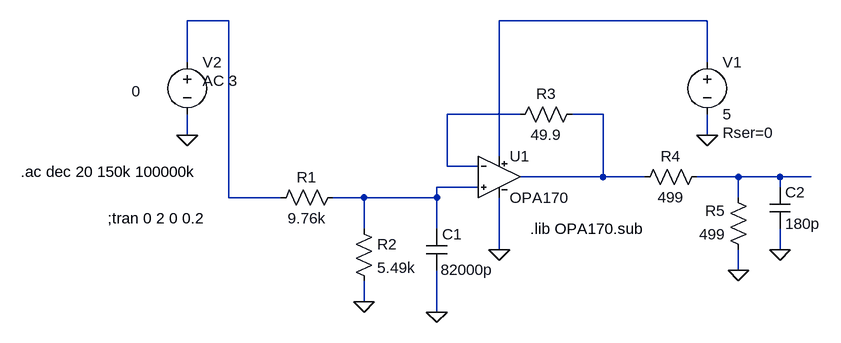
[diagram p0: schematic Analog_IN_0-10V.asc]
Analog_IN_0-10V.asc, the LTspice schematic file:
Version 4
SHEET 1 880 680
WIRE -224 -96 -288 -96
WIRE 512 -96 192 -96
WIRE -288 -32 -288 -96
WIRE 512 -32 512 -96
WIRE 224 48 112 48
WIRE 352 48 304 48
WIRE -288 80 -288 48
WIRE 512 80 512 48
WIRE 192 112 192 -96
WIRE 112 128 112 48
WIRE 160 128 112 128
WIRE 352 144 352 48
WIRE 352 144 224 144
WIRE 416 144 352 144
WIRE 560 144 496 144
WIRE 624 144 560 144
WIRE 672 144 624 144
WIRE 160 160 96 160
WIRE 624 160 624 144
WIRE -224 176 -224 -96
WIRE -144 176 -224 176
WIRE -16 176 -64 176
WIRE 96 176 96 160
WIRE 96 176 -16 176
WIRE 560 176 560 144
WIRE -16 224 -16 176
WIRE 96 224 96 176
WIRE 192 256 192 176
WIRE 624 256 624 224
WIRE 560 288 560 256
WIRE -16 336 -16 304
WIRE 96 352 96 288
FLAG -16 336 0
FLAG 512 80 0
FLAG -288 80 0
FLAG 192 256 0
FLAG 560 288 0
FLAG 96 352 0
FLAG 624 256 0
SYMBOL res -48 160 R90
WINDOW 0 0 56 VBottom 2
WINDOW 3 32 56 VTop 2
SYMATTR InstName R1
SYMATTR Value 9.76k
SYMBOL res -32 208 R0
SYMATTR InstName R2
SYMATTR Value 5.49k
SYMBOL voltage 512 -48 R0
WINDOW 123 0 0 Left 2
WINDOW 39 24 124 Left 2
SYMATTR SpiceLine Rser=0
SYMATTR InstName V1
SYMATTR Value 5
SYMBOL voltage -288 -48 R0
WINDOW 123 24 44 Left 2
WINDOW 39 24 180 Left 2
WINDOW 3 -85 60 Left 2
SYMATTR Value2 AC 3
SYMATTR InstName V2
SYMATTR Value 0
SYMBOL Opamps\\OPA170 192 80 R0
SYMATTR InstName U1
SYMBOL res 320 32 R90
WINDOW 0 0 56 VBottom 2
WINDOW 3 32 56 VTop 2
SYMATTR InstName R3
SYMATTR Value 49.9
SYMBOL res 512 128 R90
WINDOW 0 0 56 VBottom 2
WINDOW 3 32 56 VTop 2
SYMATTR InstName R4
SYMATTR Value 499
SYMBOL res 576 272 R180
WINDOW 0 36 76 Left 2
WINDOW 3 36 40 Left 2
SYMATTR InstName R5
SYMATTR Value 499
SYMBOL cap 80 224 R0
WINDOW 3 22 63 Left 2
SYMATTR InstName C1
SYMATTR Value 82000p
SYMATTR SpiceLine V=50 Irms=459m Rser=0.256209 Lser=0
SYMBOL cap 608 160 R0
SYMATTR InstName C2
SYMATTR Value 180p
TEXT 240 224 Left 2 !.lib OPA170.sub
TEXT -410 208 Left 2 !;tran 0 2 0 0.2
TEXT -544 136 Left 2 !.ac dec 20 150k 100000k

The netlist it stands for:
* Analog_IN_0-10V.asc
R1 N006 N001 9.76k
R2 N006 0 5.49k
V1 N002 0 5 Rser=0
V2 N001 0 0 AC 3
XU1 N003 N006 0 N002 N004 OPA170  ; pins In- In+ V- V+ OUT
R3 N004 N003 49.9
R4 N005 N004 499
R5 0 N005 499
C1 N006 0 82000p V=50 Irms=459m Rser=0.256209 Lser=0
C2 N005 0 180p
.lib OPA170.sub
;tran 0 2 0 0.2
.ac dec 20 150k 100000k
.lib OPA170.sub
.backanno
.end